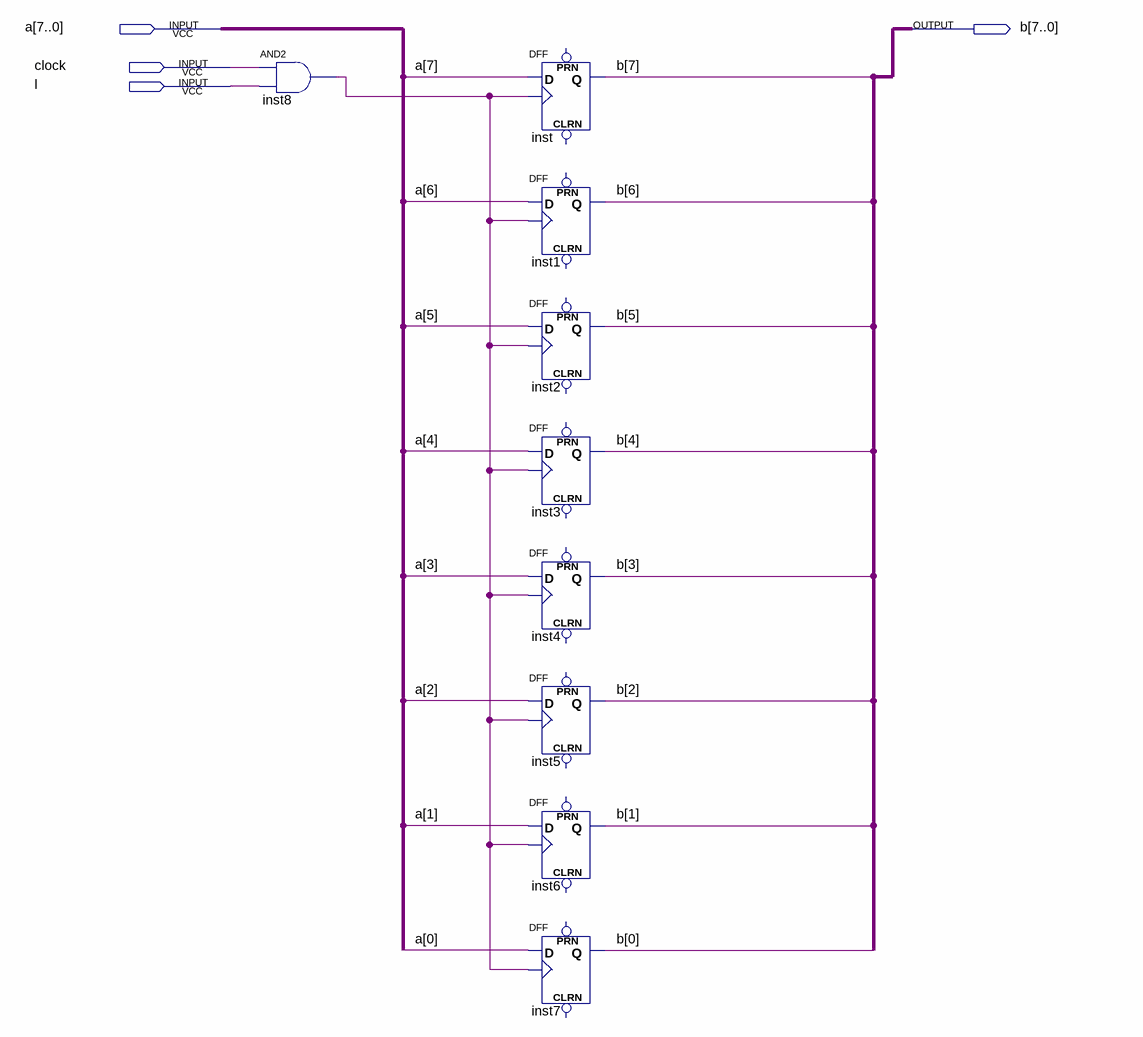
[diagram p0: schematic sheet]
// Quartus schematic register.bdf as structural Verilog: 9 symbols, 4 pins
module register (
  input  [7:0] a,
  input  clock,
  input  l,
  output [7:0] b
);

  wire inst8_out;

  and inst8 (inst8_out, clock, l);
  DFF inst (.CLK(inst8_out), .D(a[7]), .Q(b[7]));  // open: CLRN, PRN
  DFF inst1 (.CLK(inst8_out), .D(a[6]), .Q(b[6]));  // open: CLRN, PRN
  DFF inst2 (.CLK(inst8_out), .D(a[5]), .Q(b[5]));  // open: CLRN, PRN
  DFF inst3 (.CLK(inst8_out), .D(a[4]), .Q(b[4]));  // open: CLRN, PRN
  DFF inst4 (.CLK(inst8_out), .D(a[3]), .Q(b[3]));  // open: CLRN, PRN
  DFF inst5 (.CLK(inst8_out), .D(a[2]), .Q(b[2]));  // open: CLRN, PRN
  DFF inst6 (.CLK(inst8_out), .D(a[1]), .Q(b[1]));  // open: CLRN, PRN
  DFF inst7 (.CLK(inst8_out), .D(a[0]), .Q(b[0]));  // open: CLRN, PRN
endmodule
